# Altium schematic sheet 2_astabilny generator sygnalu.SchDoc
size A4
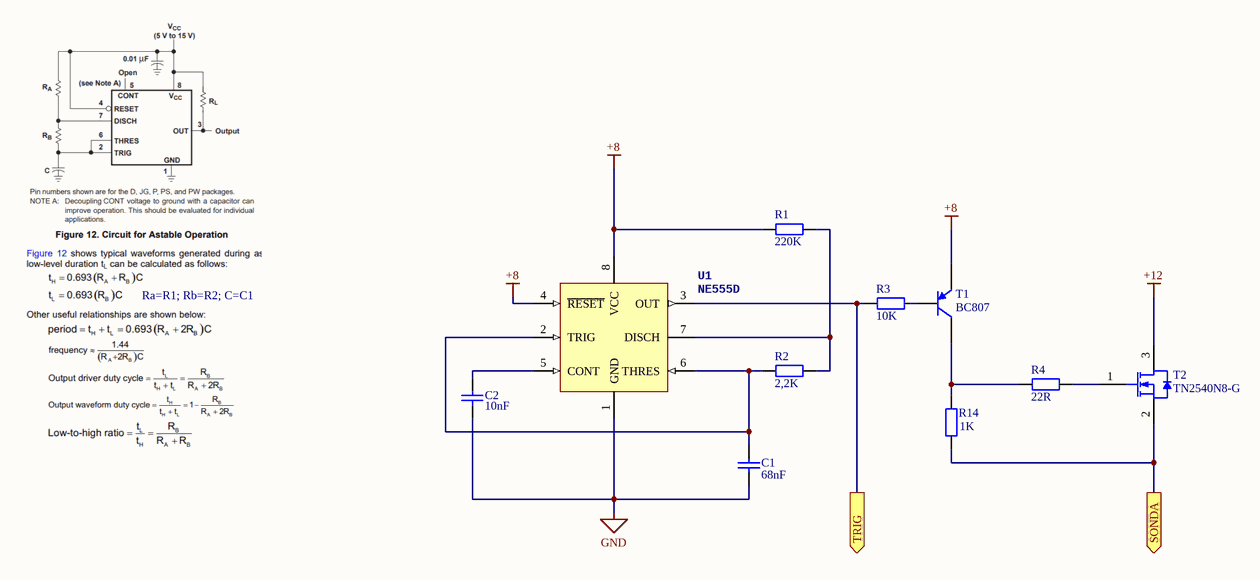
[diagram p0: 2_astabilny generator sygnalu.SchDoc]

## Parts
C1  Capacitance: 68nF  [CAPC1608X95X40NL15T15]  (hidden comment: VJ0603Y683KXJCW1BC)
C2  Capacitance: 10nF  [CAPC1608X92X38NL15T08]  (hidden comment: VJ0603Y103KNAAO)
R1  value 220K  [R1206]  (hidden comment: 1206S4J0224T5E@TME)
R2  value 2,2K  [R1206]  (hidden comment: 1206S4J0222T5E@TME)
R3  value 10K  [R1206]  (hidden comment: 1206S4J0103T5E@TME)
R4  value 22R  [R1206]  (hidden comment: 1206S4J0220T5E@TME)
R14  value 1K  [R1206]  (hidden comment: 1206S4J0102T5E@TME)
T1  BC807  [ONSC-SOT-23-3-318-08_V]
T2  TN2540N8-G  [FAIR-SOT23-3_A_V]
U1  NE555D  [D0008A_N]

## Ports
SONDA (out), TRIG (out)

## Nets
+8: R1.1 T1.2(E) U1.4(~{RESET}) U1.8(VCC)
+12: T2.3(D)
GND: C1.1 C2.1 U1.1(GND)
SONDA: R14.1 T2.2(S) ; port SONDA
TRIG: R3.1 U1.3(OUT) ; port TRIG
NetC1_2: C1.2 R2.1 U1.2(TRIG) U1.6(THRES)
NetC2_2: C2.2 U1.5(CONT)
NetR1_2: R1.2 R2.2 U1.7(DISCH)
NetR3_2: R3.2 T1.1(B)
NetR4_1: R4.1 R14.2 T1.3(C)
NetR4_2: R4.2 T2.1(G)

## Notes on the sheet
- Ra=R1; Rb=R2; C=C1

## Library data of the parts
C1 = CMP-2006-01832-1: Manufacturer: Vitramon; Part Number: VJ0603Y683KXJCW1BC
C2 = CMP-2006-01968-1: Manufacturer: Vitramon; Part Number: VJ0603Y103KNAAO
R1-R4 R14 = Res: Resistor
T1 = CMP-1048-00691-1: General Purpose Transistor, PNP Silicon, 3-Pin SOT-23, Pb-Free, Tape and Reel; Manufacturer: On Semiconductor; PartNumber: BC807-25LT1G; IC Continuous (A): -0.5; fT Min (MHz): 100; PackageDescription: 3-Pin Small Outline Transistor, Body 2.92 x 1.3 mm, Pitch 0.95 mm; Polarity: PNP; ComponentLink2URL: http://www.onsemi.com/pub_link/Collateral/BC807-16LT1-D.PDF; PackageReference: SOT-23-3-318-08; ComponentLink2Description: Datasheet; ComponentLink1Description: Manufacturer URL; ComponentLink3URL: http://www.onsemi.cn/pub_link/Collateral/318-08.PDF; Packing: Tape and Reel; DatasheetVersion: Rev. 10; RoHS: TRUE; ComponentLink3Description: Package Specification; PackageVersion: Rev. AP, 11/2009; ComponentLink1URL: http://www.onsemi.com/; Mounting Technology: Surface Mount
T2 = CMP-2000-06254-1: N-Channel Logic Level PowerTrench(TM) MOSFET, 30 V, 2.7 A, -55 to 150 degC, 3-Pin SOT23, RoHS, Tape and Reel; Manufacturer: FairchildSemiconductor; RDS-on: 46@10VmOhm; Rad Hard: No; Typical Turn-On Delay Time: 6ns; Typical Fall Time: 4ns; Channel Mode: Enhancement; Channel Type: N; Maximum Drain Source Voltage: 30V; Maximum Continuous Drain Current: 2.7A; Typical Rise Time: 13ns; Typical Turn-Off Delay Time: 15ns; Maximum Gate Source Voltage: ±20V; Package: 3SuperSOT; Category: MOSFET; Datasheet Version: Rev. C, 04/1999; Packaging: Tape&Reel; Operating Temperature: -55to150°C; Package Reference: SOT23-3; Datasheet URL: https://www.fairchildsemi.com/datasheets/FD/FDN359AN.pdf; Manufacturer URL: https://www.fairchildsemi.com/; Mounting: SurfaceMount; Mounting Technology: SurfaceMount; Package Description: 3-Pin Small Outline Transistor, Body 2.92 x 1.4 mm, Pitch 0.95 mm; Package URL: https://www.fairchildsemi.com/package-drawings/MA/MA03B.pdf
U1 = CMP-2000-06840-1: Precision Timer, 4.5 to 16 V, 0 to 70 degC, 8-Pin SOIC (D), Green (RoHS & no Sb/Br), Tube; PartNumber: NE555; Manufacturer: Texas Instruments; Base Number: 555; No. of Timers: 1; Supply Voltage Min: 4.5V; Operating Frequency Max: 0.5MHz; Supply Voltage Range: 4.5Vto16V; No. of Pins: 8; Supply Voltage Max: 16V; IC Temperature Range: Commercial; SVHC: NoSVHC(19-Dec-2012); Operating Mode: Astable,Monostable; Frequency: 500kHz; Package Description: 8-Pin Small Outline Integrated Circuit, Body 4.9 x 3.9 mm, Pitch 1.27 mm; Datasheet URL: http://www.ti.com/general/docs/lit/getliterature.tsp?genericPartNumber=NE555&fileType=pdf; Mounting Technology: SurfaceMount; Operating Temperature Range: 0°Cto+70°C; Operating Temperature Min: 0°C; Package URL: http://www.ti.com/lit/ml/msoi002j/msoi002j.pdf; Datasheet Version: Rev. I, 09/2014; Manufacturer URL: http://www.ti.com/; Digital IC Case Style: SOIC; Clock External Input: No; Logic Function Number: 555; IC Generic Number: 555; No. of Channels: 1; Operating Temperature Max: 70°C; Package / Case: SOIC; Package Reference: D8; Device Marking: NE555D